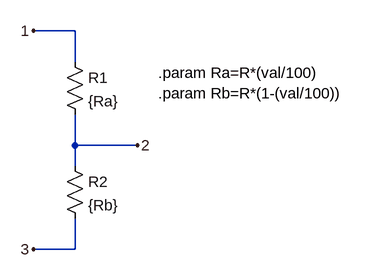
[diagram p0: schematic pot.asc]
pot.asc, the LTspice schematic file:
Version 4.1
SHEET 1 880 680
WIRE 176 16 112 16
WIRE 176 64 176 16
WIRE 176 192 176 144
WIRE 272 192 176 192
WIRE 176 224 176 192
WIRE 176 352 176 304
WIRE 176 352 112 352
FLAG 112 16 1
FLAG 272 192 2
FLAG 112 352 3
SYMBOL res 160 48 R0
SYMATTR InstName R1
SYMATTR Value {Ra}
SYMBOL res 160 208 R0
SYMATTR InstName R2
SYMATTR Value {Rb}
TEXT 304 80 Left 2 !.param Ra=R*(val/100)
TEXT 304 112 Left 2 !.param Rb=R*(1-(val/100))

The netlist it stands for:
* pot.asc
R1 1 2 {Ra}
R2 2 3 {Rb}
.param Ra=R*(val/100)
.param Rb=R*(1-(val/100))
.backanno
.end